# EAGLE design RPi-ShieldBridge_v11 (EAGLE 6.6.0)
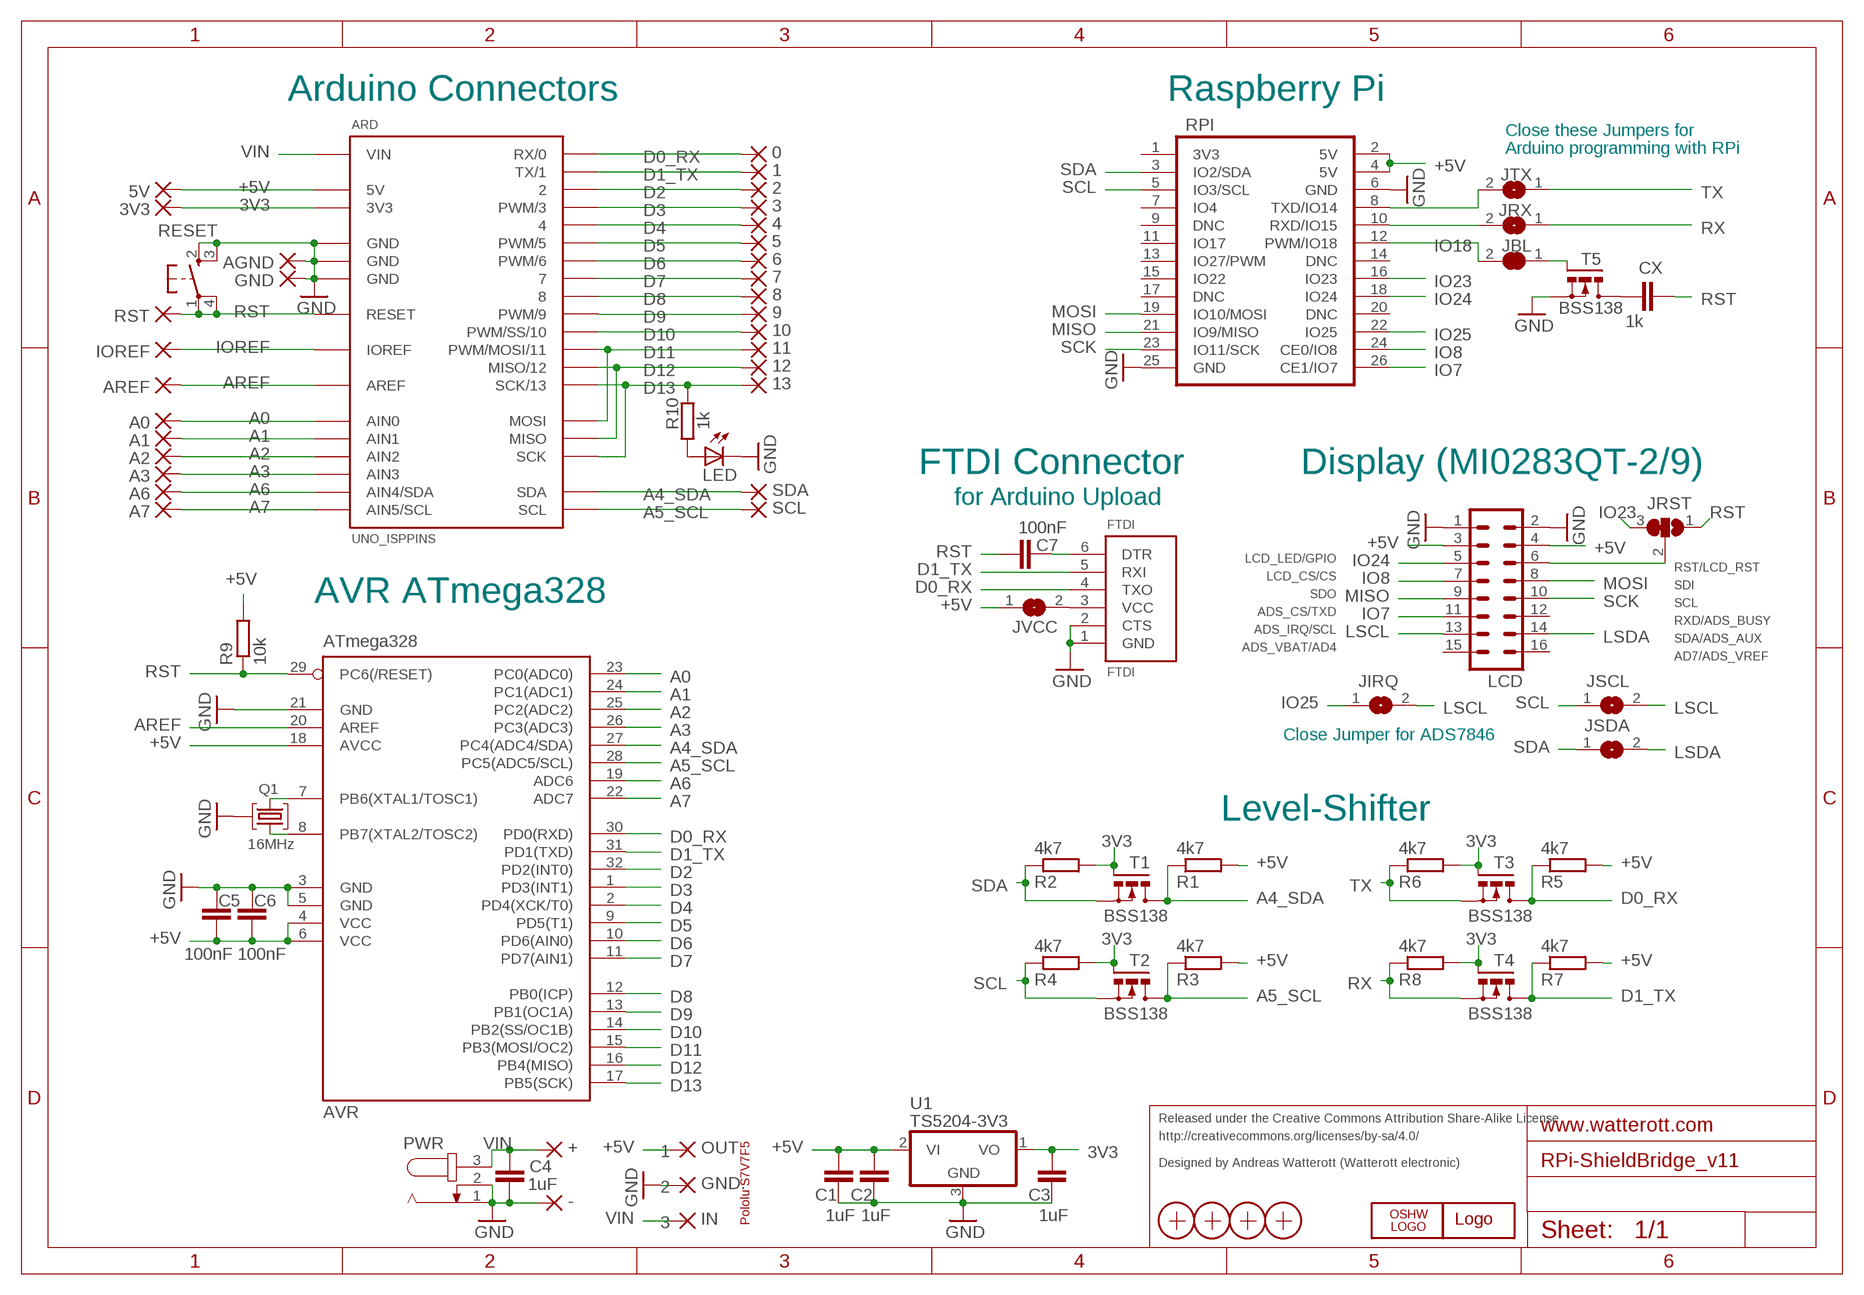
[diagram p0: schematic, sheet 1]

## Parts
0  WIREPAD1,6/0,9  [1,6/0,9]
1  WIREPAD1,6/0,9  [1,6/0,9]
2  WIREPAD1,6/0,9  [1,6/0,9]
3  WIREPAD1,6/0,9  [1,6/0,9]
3V3  WIREPAD1,6/0,9  [1,6/0,9]
4  WIREPAD1,6/0,9  [1,6/0,9]
5  WIREPAD1,6/0,9  [1,6/0,9]
5V  WIREPAD1,6/0,9  [1,6/0,9]
6  WIREPAD1,6/0,9  [1,6/0,9]
7  WIREPAD1,6/0,9  [1,6/0,9]
8  WIREPAD1,6/0,9  [1,6/0,9]
9  WIREPAD1,6/0,9  [1,6/0,9]
10  WIREPAD1,6/0,9  [1,6/0,9]
11  WIREPAD1,6/0,9  [1,6/0,9]
12  WIREPAD1,6/0,9  [1,6/0,9]
13  WIREPAD1,6/0,9  [1,6/0,9]
+  WIREPAD2,54/1,0  [2,54/1,0]
-  WIREPAD2,54/1,0  [2,54/1,0]
A0  WIREPAD1,6/0,9  [1,6/0,9]
A1  WIREPAD1,6/0,9  [1,6/0,9]
A2  WIREPAD1,6/0,9  [1,6/0,9]
A3  WIREPAD1,6/0,9  [1,6/0,9]
A6  WIREPAD1,6/0,9  [1,6/0,9]
A7  WIREPAD1,6/0,9  [1,6/0,9]
AGND  WIREPAD1,6/0,9  [1,6/0,9]
ARD  UNO_ISPPINS  [UNO_ISP3]
AREF  WIREPAD1,6/0,9  [1,6/0,9]
AVR  ATmega328  MEGA8-AI  [TQFP32-08]
C1  1uF  C-EUC0603  [C0603]
C2  1uF  C-EUC0603  [C0603]
C3  1uF  C-EUC0603  [C0603]
C4  1uF  C-EUC0603  [C0603]
C5  100nF  C-EUC0603  [C0603]
C6  100nF  C-EUC0603  [C0603]
C7  100nF  C-EUC0603  [C0603]
CX  1k  C-EUC0603  [C0603]
FTDI  FTDI  [FTDI]
GND  WIREPAD1,6/0,9  [1,6/0,9]
GND.  2  WIREPAD1,6/0,9  [1,6/0,9]
IN  3  WIREPAD1,6/0,9  [1,6/0,9]
IOREF  WIREPAD1,6/0,9  [1,6/0,9]
JBL  SJ  [SJ]
JIRQ  SJ  [SJ]
JRST  SJ2W  [SJ_2]
JRX  SJ  [SJ]
JSCL  SJ  [SJ]
JSDA  SJ  [SJ]
JTX  SJ  [SJ]
JVCC  SJ  [SJ]
LCD  MA08-2  [MA08-2]
LED  LEDCHIPLED_0603  [CHIPLED_0603]
LOGO1  OSHW_LOGO_6MILX0150-NT  [OSHW_6X150_NOTEXT]
OUT  1  WIREPAD1,6/0,9  [1,6/0,9]
PWR  DC-JACK""  [DC-JACK]
Q1  16MHz  SMD_OSC2  [SMD_OSC_35X15]
R1  4k7  R-EU_R0603  [R0603]
R2  4k7  R-EU_R0603  [R0603]
R3  4k7  R-EU_R0603  [R0603]
R4  4k7  R-EU_R0603  [R0603]
R5  4k7  R-EU_R0603  [R0603]
R6  4k7  R-EU_R0603  [R0603]
R7  4k7  R-EU_R0603  [R0603]
R8  4k7  R-EU_R0603  [R0603]
R9  10k  R-EU_R0603  [R0603]
R10  1k  R-EU_R0603  [R0603]
RESET  SW_SMDS  [SW_SMD4@1]
RPI  RPI  [RPI]
RST  WIREPAD1,6/0,9  [1,6/0,9]
SCL  WIREPAD1,6/0,9  [1,6/0,9]
SDA  WIREPAD1,6/0,9  [1,6/0,9]
T1  BSS138  IRLML2502  [MICRO3]
T2  BSS138  IRLML2502  [MICRO3]
T3  BSS138  IRLML2502  [MICRO3]
T4  BSS138  IRLML2502  [MICRO3]
T5  BSS138  IRLML2502  [MICRO3]
U1  TS5204-3V3  TS5204  [SOT23]
U$1  WE-LOGO  WE-LOGOPLACE  [WE-LOGO]
X1  PASSER  [PASSER]
X2  PASSER  [PASSER]
X3  PASSER  [PASSER]
X4  PASSER  [PASSER]

## Nets
3V3: 3V3.1(P) ARD.3V3 C3.1 R2.2 R4.2 R6.2 R8.2 T1.1(G) T2.1(G) T3.1(G) T4.1(G) U1.1(VO)
+5V: 5V.1(P) ARD.5V AVR.4(VCC) AVR.6(VCC) AVR.18(AVCC) C1.1 C2.1 C5.1 C6.1 JVCC.1 LCD.3 LCD.4 OUT.1(P) R1.2 R3.2 R5.2 R7.2 R9.2 RPI.2(5V) RPI.4(5V) U1.2(VI)
A0: A0.1(P) ARD.AIN0 AVR.23(PC0(ADC0))
A1: A1.1(P) ARD.AIN1 AVR.24(PC1(ADC1))
A2: A2.1(P) ARD.AIN2 AVR.25(PC2(ADC2))
A3: A3.1(P) ARD.AIN3 AVR.26(PC3(ADC3))
A4_SDA: ARD.SDA AVR.27(PC4(ADC4/SDA)) R1.1 SDA.1(P) T1.3(D)
A5_SCL: ARD.SCL AVR.28(PC5(ADC5/SCL)) R3.1 SCL.1(P) T2.3(D)
A6: A6.1(P) ARD.AIN4(AIN4/SDA) AVR.19(ADC6)
A7: A7.1(P) ARD.AIN5(AIN5/SCL) AVR.22(ADC7)
AREF: ARD.AREF AREF.1(P) AVR.20(AREF)
D0_RX: 0.1(P) ARD.0(RX/0) AVR.30(PD0(RXD)) FTDI.4(TXO) R5.1 T3.3(D)
D1_TX: 1.1(P) ARD.1(TX/1) AVR.31(PD1(TXD)) FTDI.5(RXI) R7.1 T4.3(D)
D2: 2.1(P) ARD.2 AVR.32(PD2(INT0))
D3: 3.1(P) ARD.3(PWM/3) AVR.1(PD3(INT1))
D4: 4.1(P) ARD.4 AVR.2(PD4(XCK/T0))
D5: 5.1(P) ARD.5(PWM/5) AVR.9(PD5(T1))
D6: 6.1(P) ARD.6(PWM/6) AVR.10(PD6(AIN0))
D7: 7.1(P) ARD.7 AVR.11(PD7(AIN1))
D8: 8.1(P) ARD.8 AVR.12(PB0(ICP))
D9: 9.1(P) ARD.9(PWM/9) AVR.13(PB1(OC1A))
D10: 10.1(P) ARD.10(PWM/SS/10) AVR.14(PB2(SS/OC1B))
D11: 11.1(P) ARD.11(PWM/MOSI/11) ARD.MOSI AVR.15(PB3(MOSI/OC2))
D12: 12.1(P) ARD.12(MISO/12) ARD.MISO AVR.16(PB4(MISO))
D13: 13.1(P) ARD.13(SCK/13) ARD.SCK AVR.17(PB5(SCK)) R10.1
DTR: C7.1 FTDI.6(DTR)
GND: -.1(P) AGND.1(P) ARD.GND@1(GND) ARD.GND@2(GND) ARD.GND@3(GND) AVR.3(GND) AVR.5(GND) AVR.21(GND) C1.2 C2.2 C3.2 C4.2 C5.2 C6.2 FTDI.1(GND) FTDI.2(CTS) GND.1(P) GND..1(P) LCD.1 LCD.2 LED.C PWR.1 PWR.2 Q1.GND RESET.2(S) RESET.3(S1) RPI.6(GND) RPI.25(GND) T5.2(S) U1.3(GND)
IO7: LCD.11 RPI.26(CE1/IO7)
IO8: LCD.7 RPI.24(CE0/IO8)
IO18: JBL.2 RPI.12(PWM/IO18)
IO23: JRST.3 RPI.16(IO23)
IO24: LCD.5 RPI.18(IO24)
IO25: JIRQ.1 RPI.22(IO25)
IOREF: ARD.IOREF IOREF.1(P)
LCD_RST: JRST.2 LCD.6
LSCL: JIRQ.2 JSCL.2 LCD.13
LSDA: JSDA.2 LCD.14
MISO: LCD.9 RPI.21(IO9/MISO)
MOSI: LCD.8 RPI.19(IO10/MOSI)
N$1: AVR.8(PB7(XTAL2/TOSC2)) Q1.2
N$2: AVR.7(PB6(XTAL1/TOSC1)) Q1.1
N$11: CX.1 T5.3(D)
N$12: LED.A R10.2
RPI_RST: JBL.1 T5.1(G)
RST: ARD.RST(RESET) AVR.29(PC6(/RESET)) C7.2 CX.2 JRST.1 R9.1 RESET.1(P) RESET.4(P1) RST.1(P)
RX: JRX.1 R8.1 T4.2(S)
RX_IO15: JRX.2 RPI.10(RXD/IO15)
SCK: LCD.10 RPI.23(IO11/SCK)
SCL: JSCL.1 R4.1 RPI.5(IO3/SCL) T2.2(S)
SDA: JSDA.1 R2.1 RPI.3(IO2/SDA) T1.2(S)
TX: JTX.1 R6.1 T3.2(S)
TX_IO14: JTX.2 RPI.8(TXD/IO14)
VCC: FTDI.3(VCC) JVCC.2
VIN: +.1(P) ARD.VIN C4.1 IN.1(P) PWR.3
Unconnected: LCD.12 LCD.15 LCD.16 RPI.1(3V3) RPI.7(IO4) RPI.9(DNC) RPI.11(IO17) RPI.13(IO27/PWM) RPI.14(DNC) RPI.15(IO22) RPI.17(DNC) RPI.20(DNC)

## Notes on the sheet
- Arduino Connectors | Raspberry Pi
- Close these Jumpers for
- Arduino programming with RPi
- FTDI Connector | Display (MI0283QT-2/9)
- for Arduino Upload
- LCD_LED/GPIO
- LCD_CS/CS | RST/LCD_RST
- SDO | SDI
- AVR ATmega328
- ADS_CS/TXD | SCL
- ADS_IRQ/SCL | RXD/ADS_BUSY
- ADS_VBAT/AD4 | SDA/ADS_AUX
- AD7/ADS_VREF
- Close Jumper for ADS7846
- Level-Shifter
- Released under the Creative Commons Attribution Share-Alike License
- http://creativecommons.org/licenses/by-sa/4.0/
- Designed by Andreas Watterott (Watterott electronic)
- Pololu S7V7F5

## Library data of the parts
0 1-3 3V3 4 5 5V 6-13 + - A0 A1-A3 A6 A7 AGND AREF GND GND. IN IOREF OUT RST SCL SDA = wirepad:WIREPAD: Wire PAD connect wire on PCB
ARD = Arduino:UNO_ISP: Arduino UNO
AVR = atmel:MEGA8: MICROCONTROLLER 8 Kbytes FLASH, 1 kbytes SRAM, 512 bytes EEPROM, USART, 6-channel 10 bit ADC, 2-channel 8 bit ADC Pin compatible with Atmega48, ATMega88, ATMega168 Source: avr.lbr; MPN: ATMEGA8-16AU; OC_FARNELL: 9171371; OC_NEWARK: 73M8863
C1-C7 CX = rcl:C-EU: CAPACITOR, European symbol
FTDI = Arduino:FTDI: 6pol FTDI Connector
JBL JIRQ JRX JSCL JSDA JTX JVCC = jumper:SJ: SMD solder JUMPER
JRST = jumper:SJ2W: SMD solder JUMPER
LCD = con-lstb:MA08-2: PIN HEADER
LED = led:LED: LED OSRAM: - CHIPLED LG R971, LG N971, LY N971, LG Q971, LY Q971, LO R971, LY R971 LH N974, LH R974 LS Q976, LO Q976, LY Q976 LO Q996 - Hyper CHIPLED LW Q18S LB Q993, LB Q99A, LB R99A - SideLED LS A670, LO A670, LY A670, LG A670, LP A670 LB A673, LV A673, LT A673, LW A673 LH A674 LY A675 LS A676, LA A676, LO A676, LY A676, LW A676 LS A679, LY A679, LG A679 - Hyper Micro SIDELED® LS Y876, LA Y876, LO Y876, LY Y876 LT Y87S - SmartLED LW L88C, LW L88S LB L89C, LB L89S, LG L890 LS L89K, LO L89K, LY L89K LS L896, LA L896, LO L896, LY L896 - TOPLED LS T670, LO T670, LY T670, LG T670, LP T670 LSG T670, LSP T670, LSY T670, LOP T670, LYG T670 LG T671, LOG T671, LSG T671 LB T673, LV T673, LT T673, LW T673 LH T674 LS T676, LA T676, LO T676, LY T676, LB T676, LH T676, LSB T676, LW T676 LB T67C, LV T67C, LT T67C, LS T67K, LO T67K, LY T67K, LW E67C LS E67B, LA E67B, LO E67B, LY E67B, LB E67C, LV E67C, LT E67C LW T67C LS T679, LY T679, LG T679 LS T770, LO T770, LY T770, LG T770, LP T770 LB T773, LV T773, LT T773, LW T773 LH T774 LS E675, LA E675, LY E675, LS T675 LS T776, LA T776, LO T776, LY T776, LB T776 LHGB T686 LT T68C, LB T68C - Hyper Mini TOPLED® LB M676 - Mini TOPLED Santana® LG M470 LS M47K, LO M47K, LY M47K Source: http://www.osram.convergy.de LUXEON: - LUMILED® LXK2-PW12-R00, LXK2-PW12-S00, LXK2-PW14-U00, LXK2-PW14-V00 LXK2-PM12-R00, LXK2-PM12-S00, LXK2-PM14-U00 LXK2-PE12-Q00, LXK2-PE12-R00, LXK2-PE12-S00, LXK2-PE14-T00, LXK2-PE14-U00 LXK2-PB12-K00, LXK2-PB12-L00, LXK2-PB12-M00, LXK2-PB14-N00, LXK2-PB14-P00, LXK2-PB14-Q00 LXK2-PR12-L00, LXK2-PR12-M00, LXK2-PR14-Q00, LXK2-PR14-R00 LXK2-PD12-Q00, LXK2-PD12-R00, LXK2-PD12-S00 LXK2-PH12-R00, LXK2-PH12-S00 LXK2-PL12-P00, LXK2-PL12-Q00, LXK2-PL12-R00 Source: www.luxeon.com KINGBRIGHT: KA-3528ASYC Source: www.kingbright.com
LOGO1 = OSHW:OSHW_LOGO_6MIL
PWR = V-Reg-Power:DC-JACK: DC POWER JACK Power Jack, DC, Right Angle, Through Hole, Rated 5A at 16VDC, PC Terminals Distributor: Farnell (www.Farnell.de) Drawing: 84N1161.pdf / 84N1162.pdf Manufacturer: SPC Technology (www.spctechnology.com) Type: SPC4077 / SPC 4078; OC_FARNELL: unknown; OC_NEWARK: unknown
Q1 = Crystal:SMD_OSC
R1-R10 = rcl:R-EU_: RESISTOR, European symbol
RESET = Switch-SMD:SW_SMD
RPI = RaspberryPi:RPI; OC_FARNELL: unknown; OC_NEWARK: unknown
T1-T5 = IRF-sot23:IRLML2502: N-Channel Power MOSFET
U1 = Voltage-Reg:TS5204
U$1 = welectronic:WE-LOGO
X1-X4 = SMD:PASSER

## Board
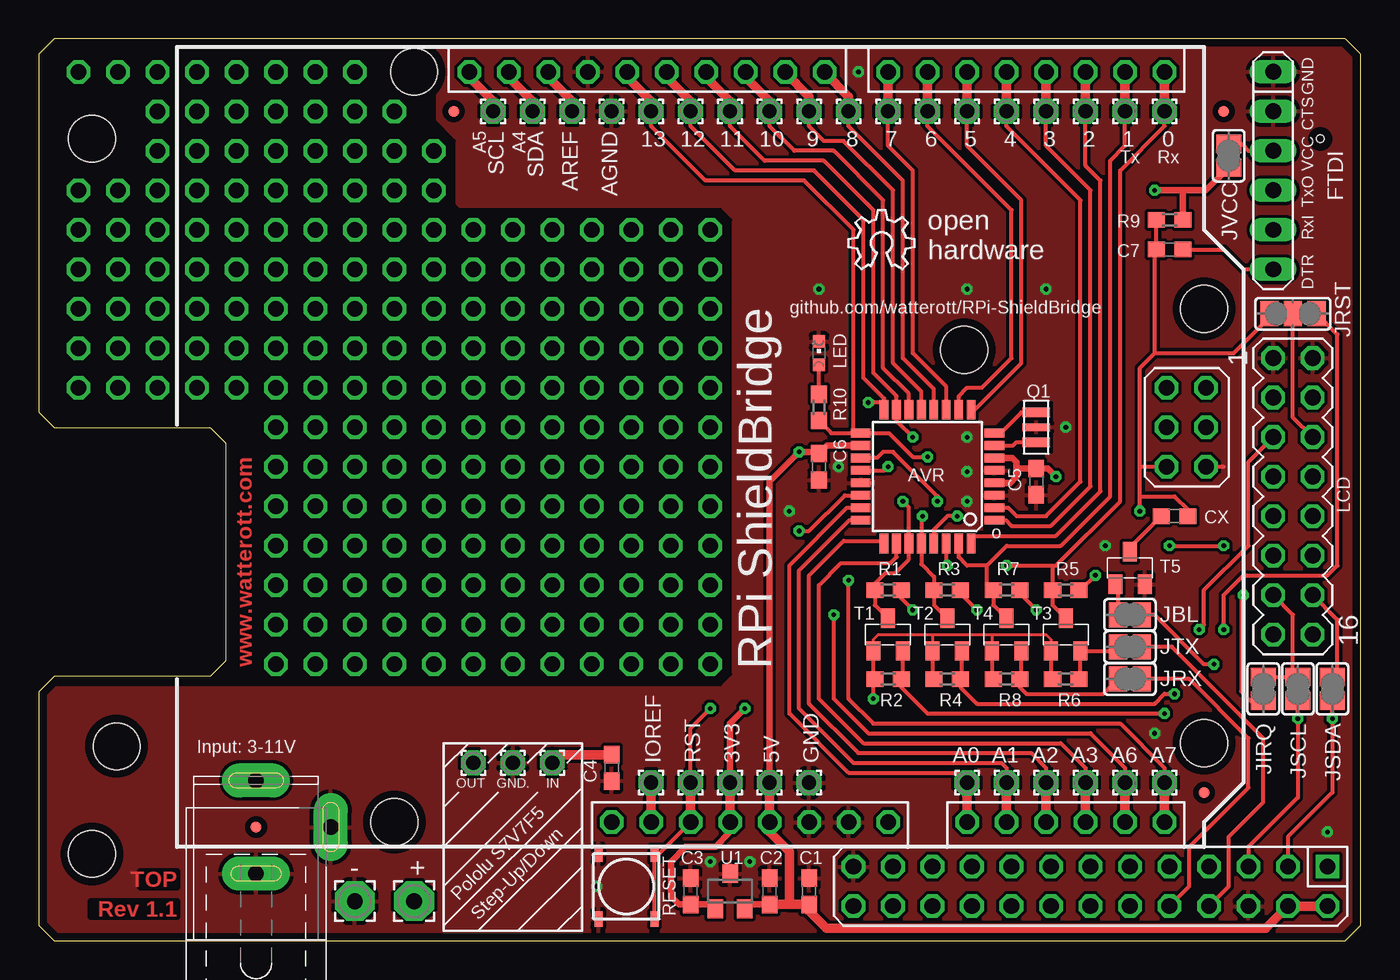
[diagram p1: board, top side]
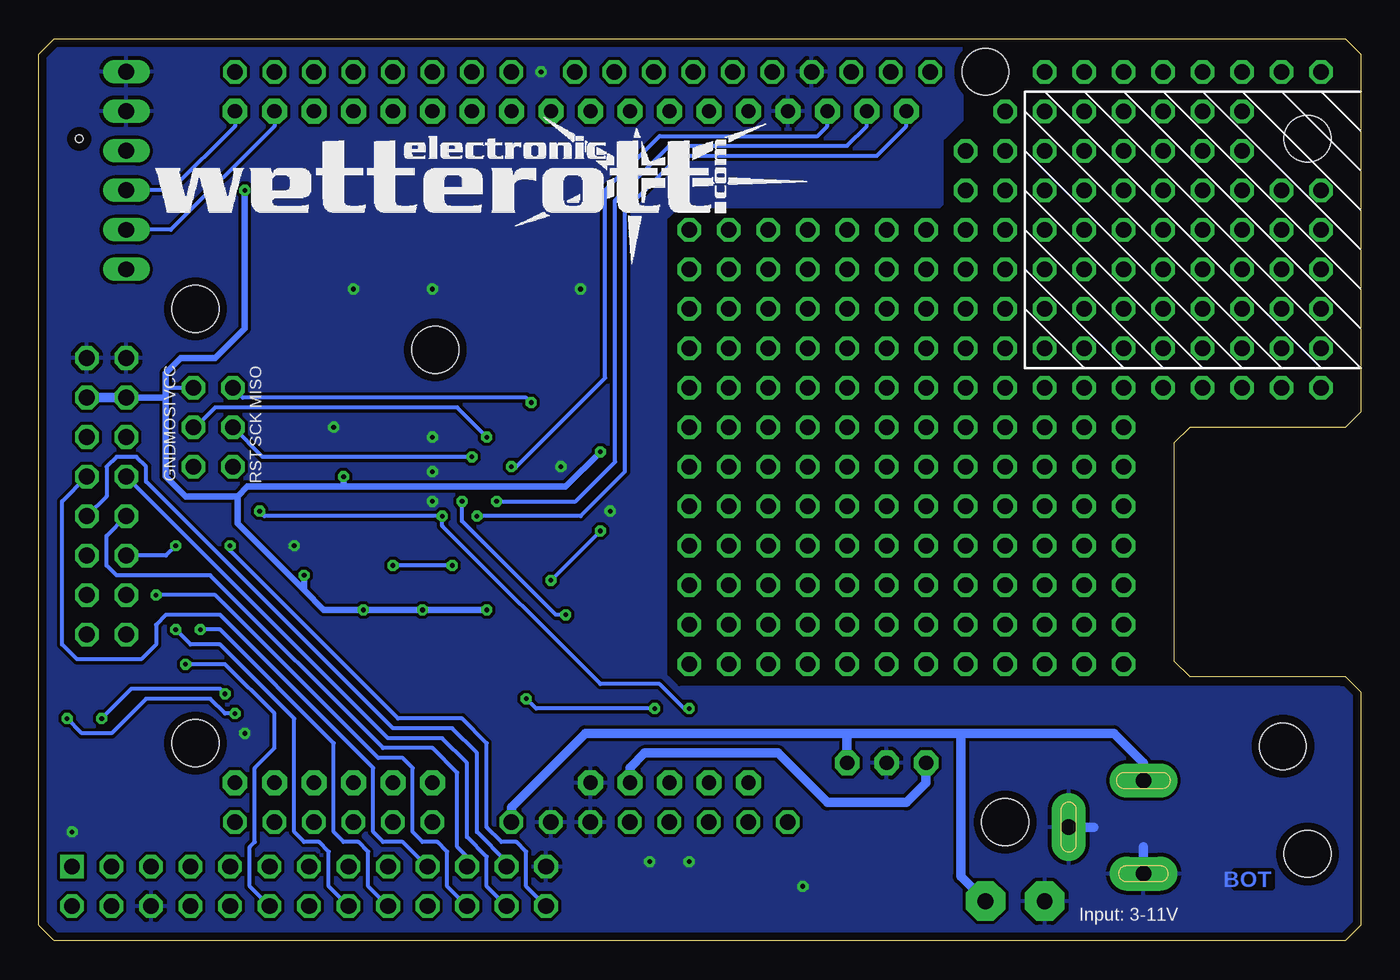
[diagram p2: board, bottom side, seen from below]

Size 85 x 58 mm. Coordinates in mm from the lower left corner, seen from the top.
Outline: 1,0 84,0 85,1 85,57 84,58 1,58 0,57 0,34 1,33 11,33 12,32 12,18 11,17 1,17 0,16 0,1 1,0
Copper layers (1*16): Top 0.035mm / dielectric 1.5mm / Bottom 0.035mm
Design rules "default *": minimum track width 8mil, minimum drill 0.3mm, track to track 8mil, track to pad 8mil, pad to pad 8mil, via to via 8mil, smd to smd 8mil, copper to edge 20mil, drill to drill 8mil, minimum pad ring 10mil, minimum via ring 8mil, stop-mask expansion 4mil, vias tented up to drill 0.5mm, thermal gap 10mil
Holes 3 mm at 5,12.5 59.5,38 3.41,5.58 3.41,51.58
Holes 0.5 mm at 82.41,51.58
tRestrict: area 61,31.4 to 65.1,34.6; area 1.3,16.5 to 44.5,57.1
bRestrict: area 1.3,16.5 to 44.5,57.1

### Footprints (pad centres in the part's own frame; a part is rotated, then mirrored left to right if it is on the bottom)
1,6/0,9 = drill 0.914 pad 1.6 octagon: 1 0,0
2,54/1,0 = drill 1.016 pad 2.54 octagon: 1 0,0
UNO_ISP3 = drill 1 octagon: 0 63.5,50.8; 1 60.96,50.8; 2 58.42,50.8; 3 55.88,50.8; 3V3 35.56,2.54; 4 53.34,50.8; 5 50.8,50.8; 5V 38.1,2.54; 6 48.26,50.8; 7 45.72,50.8; 8 41.656,50.8; 9 39.116,50.8; 10 36.576,50.8; 11 34.036,50.8; 12 31.496,50.8; 13 28.956,50.8; AIN0 50.8,2.54; AIN1 53.34,2.54; AIN2 55.88,2.54; AIN3 58.42,2.54; AIN4 60.96,2.54; AIN5 63.5,2.54; AREF 23.876,50.8; GND@1 40.64,2.54; GND@2 43.18,2.54; GND@3 26.416,50.8; GND@4 66.167,25.4; IOREF 30.48,2.54; MISO 63.627,30.48; MOSI 66.167,27.94; NC 27.94,2.54; RST 33.02,2.54; RST2 63.627,25.4; SCK 63.627,27.94; SCL 18.796,50.8; SDA 21.336,50.8; VCC 66.167,30.48; VIN 45.72,2.54 | hole 3: 66.04,35.56; 66.04,7.62; 15.24,50.8; 13.97,2.54
TQFP32-08 = smd 1.27 x 0.559: 1 -4.293,2.8; 2 -4.293,2; 3 -4.293,1.2; 4 -4.293,0.4; 5 -4.293,-0.4; 6 -4.293,-1.2; 7 -4.293,-2; 8 -4.293,-2.8; 17 4.293,-2.8; 18 4.293,-2; 19 4.293,-1.2; 20 4.293,-0.4; 21 4.293,0.4; 22 4.293,1.2; 23 4.293,2; 24 4.293,2.8 | smd 0.559 x 1.27: 9 -2.8,-4.293; 10 -2,-4.293; 11 -1.2,-4.293; 12 -0.4,-4.293; 13 0.4,-4.293; 14 1.2,-4.293; 15 2,-4.293; 16 2.8,-4.293; 25 2.8,4.293; 26 2,4.293; 27 1.2,4.293; 28 0.4,4.293; 29 -0.4,4.293; 30 -1.2,4.293; 31 -2,4.293; 32 -2.8,4.293
C0603 = smd 1.1 x 1: 1 -0.85,0; 2 0.85,0
FTDI = drill 1.016 long: 1 -6.35,0; 2 -3.81,0; 3 -1.27,0; 4 1.27,0; 5 3.81,0; 6 6.35,0
SJ = smd 1.168 x 1.6: 1 -0.762,0; 2 0.762,0
SJ_2 = smd 1.168 x 1.6: 1 -1.524,0; 2 0,0; 3 1.524,0
MA08-2 = drill 1.016 octagon: 1 -8.89,-1.27; 2 -8.89,1.27; 3 -6.35,-1.27; 4 -6.35,1.27; 5 -3.81,-1.27; 6 -3.81,1.27; 7 -1.27,-1.27; 8 -1.27,1.27; 9 1.27,-1.27; 10 1.27,1.27; 11 3.81,-1.27; 12 3.81,1.27; 13 6.35,-1.27; 14 6.35,1.27; 15 8.89,-1.27; 16 8.89,1.27
CHIPLED_0603 = smd 0.8 x 0.8: A 0,-0.75; C 0,0.75
DC-JACK = drill 1 pad 2.184 long: 1 -3,0; 2 0,-4.8; 3 3,0
SMD_OSC_35X15 = smd 0.635 x 1.778: 1 -0.965,0; 2 0.965,0 | smd 0.508 x 1.778: GND 0,0
R0603 = smd 1.1 x 1: 1 -0.85,0; 2 0.85,0
SW_SMD4@1 = smd 0.508 x 1.016: 1 -1.8,-2.1; 2 1.8,-2.1; 3 1.8,2.1; 4 -1.8,2.1
RPI = drill 1.016 square: 1 -15.24,-1.27 | drill 1.016 octagon: 2 -15.24,1.27; 3 -12.7,-1.27; 4 -12.7,1.27; 5 -10.16,-1.27; 6 -10.16,1.27; 7 -7.62,-1.27; 8 -7.62,1.27; 9 -5.08,-1.27; 10 -5.08,1.27; 11 -2.54,-1.27; 12 -2.54,1.27; 13 0,-1.27; 14 0,1.27; 15 2.54,-1.27; 16 2.54,1.27; 17 5.08,-1.27; 18 5.08,1.27; 19 7.62,-1.27; 20 7.62,1.27; 21 10.16,-1.27; 22 10.16,1.27; 23 12.7,-1.27; 24 12.7,1.27; 25 15.24,-1.27; 26 15.24,1.27
MICRO3 = smd 0.9 x 1.25: 1 -0.95,-1.05; 2 0.95,-1.05; 3 0,1.05
SOT23 = smd 1 x 1.2: 1 -0.95,-1.132; 2 0.95,-1.132; 3 0,1.132
PASSER = smd 0.7 x 0.7: X 0,0

### Placement (x,y rotation side)
0  72.39,53.34 0 top
1  69.85,53.34 0 top
2  67.31,53.34 0 top
3  64.77,53.34 0 top
3V3  44.45,10.16 90 top
4  62.23,53.34 0 top
5  59.69,53.34 0 top
5V  46.99,10.16 90 top
6  57.15,53.34 0 top
7  54.61,53.34 0 top
8  52.07,53.34 0 top
9  49.53,53.34 0 top
10  46.99,53.34 0 top
11  44.45,53.34 0 top
12  41.91,53.34 0 top
13  39.37,53.34 0 top
+  24.13,2.54 0 top
-  20.32,2.54 0 top
A0  59.69,10.16 0 top
A1  62.23,10.16 0 top
A2  64.77,10.16 0 top
A3  67.31,10.16 0 top
A6  69.85,10.16 0 top
A7  72.39,10.16 0 top
AGND  36.83,53.34 0 top
ARD  8.89,5.08 0 top
AREF  34.29,53.34 0 top
AVR  57.15,29.84 180 top
C1  49.53,3.17 90 top
C2  46.99,3.17 90 top
C3  41.91,3.17 90 top
C4  36.83,11.11 270 top
C5  64.14,29.53 270 top
C6  50.16,30.48 270 top
C7  72.71,44.45 180 top
CX  73.03,27.3 0 top
FTDI  79.38,49.53 270 top
GND  49.53,10.16 0 top
GND.  30.48,11.43 90 top
IN  33.02,11.43 90 top
IOREF  39.37,10.16 0 top
JBL  70.17,20.95 0 top
JIRQ  78.74,16.19 90 top
JRST  80.64,40.32 0 top
JRX  70.17,16.83 0 top
JSCL  80.96,16.19 90 top
JSDA  83.19,16.19 90 top
JTX  70.17,18.89 0 top
JVCC  76.52,50.48 90 top
LCD  80.64,28.57 270 top
LED  50.16,37.78 0 top
LOGO1  52.07,43.18 0 top
OUT  27.94,11.43 90 top
PWR  13.97,7.3 90 top
Q1  64.14,33.02 90 top
R1  54.61,22.54 0 top
R2  54.61,16.83 180 top
R3  58.42,22.54 0 top
R4  58.42,16.83 180 top
R5  66.04,22.54 0 top
R6  66.04,16.83 180 top
R7  62.23,22.54 0 top
R8  62.23,16.83 180 top
R9  72.71,46.35 0 top
R10  50.16,34.29 90 top
RESET  37.78,3.49 180 top
RPI  67.63,3.49 180 top
RST  41.91,10.16 0 top
SCL  29.21,53.34 0 top
SDA  31.75,53.34 0 top
T1  54.61,19.68 0 top
T2  58.42,19.68 0 top
T3  66.04,19.68 0 top
T4  62.23,19.68 0 top
T5  70.17,23.97 0 top
U1  44.45,3.17 0 top
U$1  77.79,43.18 0 bottom
X1  13.97,7.3 0 top
X2  26.67,53.34 0 top
X3  76.2,53.34 0 top
X4  74.93,9.53 0 top

### Tracks (layer width: path | path; a pad name or v marks a point on that pad's centre or on a via)
3V3  (via drill 0.3)
  Top 0.203: 57.47,19.68 53.98,19.68 53.66,19.37 T1.1 | 57.47,19.68 61.28,19.68 | 61.28,19.68 64.77,19.68 65.09,19.37 T3.1 | 57.47,19.68 57.47,18.73 | 61.28,19.68 61.28,18.73
  Top 0.254: 43.22,2.33 U1.1 | R4.2 57.47,16.93 T2.1 57.47,18.73 | R6.2 65.09,16.93 T3.1 | R8.2 61.28,16.93 T4.1 61.28,18.73 | T1.1 53.66,16.93 | 53.66,16.93 R2.2 | 53.66,16.93 v53.66,15.56
  Top 0.406: 43.22,2.33 C3.1 41.17,2.33 40.64,2.86 40.64,5.08 41.59,6.03 43.5,6.03 44.45,6.99 ARD.3V3 | 3V3.1 44.45,13.97 v45.4,14.92
  Top 0.61: ARD.3V3 3V3.1
  Bottom 0.254: v53.66,15.56 53.02,14.92 v45.4,14.92
+5V  (via drill 0.3)
  Top 0.254: 45.68,2.33 U1.2 | 50.06,31.43 C6.1 | 62.97,30.38 62.87,30.48 | R1.2 55.46,22.01 v56.2,21.27 | R3.2 59.27,22.33 v60.33,21.27 | R7.2 63.08,22.33 v64.14,21.27 | R5.2 66.99,22.54 v67.94,23.5
  Top 0.406: C2.1 45.68,2.33 | C1.1 49.53,1.91 | AVR.4 62.47,29.45 62.87,29.84 62.87,30.48 62.87,30.8 62.62,31.05 AVR.6 | AVR.18 50.68,31.84 C6.1 | 50.06,31.43 v48.9,31.43 46.99,29.53 5V.1 | 62.97,30.38 C5.1 64.87,30.38 v65.41,29.84 | v71.75,48.26 73.66,48.26 | 73.66,48.26 75.06,48.26 JVCC.1 | R9.2 73.56,48.16 73.66,48.26
  Top 0.61: RPI.2 RPI.4 78.9,0.79 50.64,0.79 49.53,1.91 | 48.26,2.33 C2.1 | 48.26,2.33 C1.1 | 48.26,2.33 48.26,5.71 46.99,6.99 ARD.5V 5V.1
  Bottom 0.254: 76.83,35.56 74.93,35.56
  Bottom 0.406: 65.41,29.21 v65.41,29.84 | 65.41,29.21 51.12,29.21 v48.9,31.43 | v56.2,21.27 v60.33,21.27 v64.14,21.27 66.67,21.27 67.94,22.54 | 65.41,29.21 71.6,29.21 72.23,28.57 | 72.23,28.57 72.23,26.83 67.94,22.54 | 76.83,34.92 76.83,29.84 75.56,28.57 72.23,28.57 | 76.83,34.92 76.83,35.56 76.83,36.51 75.88,37.47 73.66,37.47 71.75,39.37 v71.75,48.26 | 76.83,34.92 LCD.3 | 67.94,22.54 v67.94,23.5
  Bottom 0.61: LCD.3 LCD.4 | OUT.1 27.94,10.16 29.21,8.89 34.29,8.89 37.47,12.06 46.04,12.06 46.99,11.11 5V.1
A0
  Top 0.254: AVR.23 51.98,27.84 48.26,24.13 48.26,14.61 52.07,10.79 59.05,10.79 A0.1
  Top 0.61: A0.1 ARD.AIN0
A1
  Top 0.254: AVR.24 52.13,27.05 48.9,23.81 48.9,14.92 52.39,11.43 61.91,11.43 62.23,11.11 A1.1
  Top 0.61: A1.1 ARD.AIN1
A2
  Top 0.254: AVR.25 54.19,25.72 51.75,25.72 49.53,23.5 49.53,15.24 52.7,12.06 63.82,12.06 64.77,11.11 A2.1
  Top 0.61: A2.1 ARD.AIN2
A3
  Top 0.254: AVR.26 55.15,24.67 54.77,24.29 51.59,24.29 50.16,22.86 50.16,15.56 53.02,12.7 65.72,12.7 67.31,11.11 A3.1
  Top 0.61: A3.1 ARD.AIN3
A4_SDA  (via drill 0.3)
  Top 0.254: T1.3 53.76,21.59 R1.1 53.76,22.96 54.45,23.65 55.09,23.65 55.95,24.52 AVR.27 55.95,27.87 v55.56,28.26
  Top 0.61: ARD.SDA 30.23,55.5 31.75,53.98 SDA.1
  Bottom 0.254: SDA.1 31.75,52.39 33.02,51.12 44.45,51.12 47.94,47.62 47.94,30.8 50.48,28.26 v55.56,28.26
A5_SCL  (via drill 0.3)
  Top 0.254: T2.3 57.57,21.59 R3.1 57.57,23.39 56.75,24.21 AVR.28 56.75,27.22 v56.83,27.3
  Top 0.61: ARD.SCL 27.69,55.5 29.21,53.98 SCL.1
  Bottom 0.254: SCL.1 29.21,52.39 31.11,50.48 43.81,50.48 47.31,46.99 47.31,30.16 50.16,27.3 v56.83,27.3
A6  (via drill 0.3)
  Top 0.254: v51.12,20.95 51.12,15.56 53.34,13.34 67.63,13.34 69.85,11.11 A6.1 | AVR.19 53.91,31.05 54.29,31.43 54.93,31.43 57.78,28.57 v57.78,28.26
  Top 0.61: A6.1 ARD.AIN4
  Bottom 0.254: v51.12,20.95 51.75,20.95 57.78,26.99 v57.78,28.26
A7  (via drill 0.3)
  Top 0.254: v52.07,23.18 52.07,15.56 53.66,13.97 69.53,13.97 72.39,11.11 A7.1 | AVR.22 51.82,28.64 49.53,26.35 v48.9,26.35
  Top 0.61: A7.1 ARD.AIN5
  Bottom 0.254: v52.07,23.18 v48.9,26.35
AREF  (via drill 0.3)
  Top 0.254: AVR.20 54.38,30.25 v54.61,30.48
  Top 0.61: ARD.AREF 32.77,55.5 34.29,53.98 AREF.1
  Bottom 0.254: AREF.1 34.29,52.39 34.92,51.75 45.09,51.75 48.58,48.26 48.58,36.2 54.29,30.48 v54.61,30.48
D0_RX  (via drill 0.3)
  Top 0.254: T3.3 65.19,21.59 R5.1 65.19,24.03 65.09,24.13 | 0.1 72.39,52.39 69.53,49.53 69.53,28.26 65.41,24.13 65.09,24.13 | AVR.30 58.35,24.2 v58.42,24.13 | v62.23,24.13 65.09,24.13
  Top 0.61: 0.1 ARD.0
  Bottom 0.254: v58.42,24.13 v62.23,24.13 | FTDI.4 76.52,48.26 72.39,52.39 0.1
D1_TX
  Top 0.254: T4.3 61.38,21.59 R7.1 60.96,22.96 60.96,24.13 | AVR.31 59.15,24.67 59.69,24.13 60.96,24.13 | 60.96,24.13 62.23,25.4 65.72,25.4 68.9,28.57 68.9,50.16 69.85,51.12 1.1
  Top 0.61: 1.1 ARD.1
  Bottom 0.254: FTDI.5 76.52,45.72 69.85,52.39 1.1
D2
  Top 0.254: AVR.32 59.95,25.98 60.01,26.04 65.41,26.04 68.26,28.89 68.26,48.9 67.31,49.85 2.1
  Top 0.61: 2.1 ARD.2
D3
  Top 0.254: AVR.1 62.17,27.05 62.55,26.67 65.09,26.67 67.63,29.21 67.63,48.26 64.77,51.12 3.1
  Top 0.61: 3.1 ARD.3
D4
  Top 0.254: AVR.2 62.33,27.84 62.87,27.3 64.77,27.3 66.99,29.53 66.99,47.62 62.23,52.39 4.1
  Top 0.61: 4.1 ARD.4
D5
  Top 0.254: AVR.9 59.95,33.91 63.18,37.15 63.18,47.62 59.69,51.12 5.1
  Top 0.61: 5.1 ARD.5
D6
  Top 0.254: AVR.10 59.15,35.02 59.69,35.56 60.64,35.56 62.55,37.47 62.55,46.99 57.15,52.39 6.1
  Top 0.61: 6.1 ARD.6
D7
  Top 0.254: AVR.11 58.35,35.63 56.2,37.78 56.2,49.53 54.61,51.12 7.1
  Top 0.61: 7.1 ARD.7
D8
  Top 0.254: AVR.12 57.55,35.48 55.56,37.47 55.56,48.9 52.07,52.39 8.1 | 50.55,55.82 ARD.8
  Top 0.61: 50.55,55.82 52.07,54.29 8.1
D9
  Top 0.254: AVR.13 56.75,35.33 54.93,37.15 54.93,48.26 51.75,51.44 50.48,51.44 49.53,52.39 9.1 | 48.01,55.82 ARD.9
  Top 0.61: 48.01,55.82 49.53,54.29 9.1
D10
  Top 0.254: AVR.14 55.95,35.17 54.29,36.83 54.29,47.62 51.12,50.8 48.58,50.8 46.99,52.39 10.1
  Top 0.61: ARD.10 45.47,55.5 46.99,53.98 10.1
D11  (via drill 0.3)
  Top 0.254: 11.1 44.45,52.39 46.67,50.16 50.48,50.16 53.66,46.99 53.66,36.51 55.15,35.02 AVR.15 55.15,33.43 v56.2,32.38
  Top 0.61: ARD.11 42.93,55.5 44.45,53.98 11.1
  Bottom 0.254: ARD.MOSI 74.93,33.02 73.66,34.29 58.1,34.29 v56.2,32.38
D12  (via drill 0.3)
  Top 0.254: AVR.16 54.35,34.66 | 54.35,34.66 54.35,34.87 53.02,36.2 53.02,46.35 49.85,49.53 44.77,49.53 41.91,52.39 12.1 | 54.35,34.66 54.29,34.61 v53.34,34.61
  Top 0.61: ARD.12 40.39,55.5 41.91,53.98 12.1
  Bottom 0.254: v53.34,34.61 53.66,34.92 71.88,34.92 ARD.MISO
D13  (via drill 0.3)
  Top 0.254: R10.1 50.96,32.65 AVR.17 | 13.1 39.37,52.39 42.86,48.9 49.21,48.9 52.39,45.72 52.39,32.7 52.45,32.65 AVR.17 | AVR.17 54.67,32.65 56.2,31.11 v57.15,31.11
  Top 0.61: ARD.13 37.85,55.5 39.37,53.98 13.1
  Bottom 0.254: v57.15,31.11 70.61,31.11 ARD.SCK
DTR
  Top 0.254: FTDI.6 77.47,43.18 76.2,44.45 C7.1
GND  (via drill 0.3)
  Top 0.254: 74.93,30.48 76.2,30.48
  Bottom 0.61: PWR.1 13.97,6.03 | 17.14,7.3 PWR.2
  other vias: 45.72,5.08 43.18,5.08 66.04,33.02 59.69,30.16 51.44,30.48 59.69,28.26 59.69,32.38 50.16,41.91 48.26,27.62 64.77,41.91 59.69,41.91 68.58,25.4 71.75,13.34 52.7,55.88 35.88,3.49 82.87,6.99
  pour Top: 0,0 85,0 85,58 0,58
  pour Bottom: 0,0 85,0 85,58 0,58
IO7  (via drill 0.3)
  Top 0.254: v72.71,25.4 v76.2,25.4
  Bottom 0.254: RPI.26 53.66,3.49 53.66,5.71 54.29,6.35 55.24,6.35 56.2,7.3 56.2,12.7 57.78,14.29 61.91,14.29 72.71,25.08 v72.71,25.4 | LCD.11 76.83,24.77 v76.2,25.4
IO8
  Bottom 0.254: RPI.24 56.2,3.49 56.2,5.4 57.47,6.67 57.47,11.43 59.05,13.02 62.55,13.02 LCD.7
IO18  (via drill 0.3)
  Top 0.254: JBL.2 71.75,20.95 74.93,17.78 v75.56,17.78
  Bottom 0.254: RPI.12 71.44,3.49 71.44,6.03 71.12,6.35 71.12,11.11 69.85,12.38 69.85,14.61 73.03,17.78 v75.56,17.78
IO23  (via drill 0.3)
  Top 0.254: v76.2,20 76.2,22.23 77.47,23.5 82.87,23.5 83.5,24.13 83.5,38.99 JRST.3
  Bottom 0.254: RPI.16 66.36,3.49 66.36,5.71 66.99,6.35 67.94,6.35 68.58,6.99 68.58,14.29 73.34,19.05 75.25,19.05 v76.2,20
IO24  (via drill 0.3)
  Top 0.254: LCD.5 77.79,30.8 77.79,25.4 74.93,22.54 74.93,20.32 v74.61,20
  Bottom 0.254: RPI.18 63.82,3.49 63.82,5.71 64.45,6.35 65.41,6.35 66.04,6.99 66.04,12.7 73.34,20 v74.61,20
IO25  (via drill 0.3)
  Top 0.254: JIRQ.1 77.92,15.43 77.31,16.03 77.31,22.07 v77.47,22.23
  Bottom 0.254: RPI.22 58.74,3.49 58.74,5.71 59.37,6.35 60.33,6.35 60.96,6.99 60.96,11.11 61.59,11.75 63.18,11.75 73.66,22.23 v77.47,22.23
IOREF
  Top 0.61: ARD.IOREF IOREF.1
LCD_RST
  Top 0.254: LCD.6 80.64,33.66 JRST.2 82.23,40.32
LSCL
  Top 0.254: JIRQ.2 JSCL.2 80.64,17.27 80.64,20.95 LCD.13
LSDA
  Top 0.254: JSDA.2 83.38,16.95 83.5,16.83 83.5,20.64 LCD.14
MISO
  Bottom 0.254: LCD.9 80.64,26.04 80.64,24.13 80.01,23.5 73.98,23.5 62.87,12.38 59.69,12.38 58.1,10.79 58.1,6.03 57.47,5.4 RPI.21
MOSI
  Bottom 0.254: LCD.8 83.5,28.26 83.5,19.05 82.55,18.1 78.42,18.1 77.47,19.05 77.47,20.32 76.83,20.95 73.34,20.95 63.5,11.11 63.5,6.99 62.87,6.35 61.59,6.35 RPI.19
N$1
  Top 0.254: AVR.8 61.85,32.65 63.18,33.97 64.12,33.97 Q1.2
N$2
  Top 0.254: AVR.7 62.64,31.84 62.87,32.07 64.12,32.07 Q1.1
N$3  (via drill 1)
  other vias: 40.64,17.78
N$4  (via drill 1)
  other vias: 38.1,17.78
N$5  (via drill 1)
  other vias: 43.18,17.78
N$6  (via drill 1)
  other vias: 35.56,17.78
N$7  (via drill 1)
  other vias: 33.02,17.78
N$8  (via drill 1)
  other vias: 30.48,17.78
N$9  (via drill 1)
  other vias: 27.94,17.78
N$10  (via drill 1)
  other vias: 25.4,17.78
N$11
  Top 0.254: T5.3 70.17,25.3 CX.1
N$12
  Top 0.254: R10.2 LED.A
N$13  (via drill 1)
  other vias: 22.86,17.78
N$14  (via drill 1)
  other vias: 20.32,17.78
N$15  (via drill 1)
  other vias: 17.78,17.78
N$16  (via drill 1)
  other vias: 15.24,17.78
N$17  (via drill 1)
  other vias: 43.18,20.32
N$18  (via drill 1)
  other vias: 40.64,20.32
N$19  (via drill 1)
  other vias: 38.1,20.32
N$20  (via drill 1)
  other vias: 35.56,20.32
N$21  (via drill 1)
  other vias: 33.02,20.32
N$22  (via drill 1)
  other vias: 30.48,20.32
N$23  (via drill 1)
  other vias: 27.94,20.32
N$24  (via drill 1)
  other vias: 25.4,20.32
N$25  (via drill 1)
  other vias: 22.86,20.32
N$26  (via drill 1)
  other vias: 20.32,20.32
N$27  (via drill 1)
  other vias: 17.78,20.32
N$28  (via drill 1)
  other vias: 15.24,20.32
N$29  (via drill 1)
  other vias: 43.18,22.86
N$30  (via drill 1)
  other vias: 40.64,22.86
N$31  (via drill 1)
  other vias: 38.1,22.86
N$32  (via drill 1)
  other vias: 35.56,22.86
N$33  (via drill 1)
  other vias: 33.02,22.86
N$34  (via drill 1)
  other vias: 30.48,22.86
N$35  (via drill 1)
  other vias: 27.94,22.86
N$36  (via drill 1)
  other vias: 25.4,22.86
N$37  (via drill 1)
  other vias: 22.86,22.86
N$38  (via drill 1)
  other vias: 20.32,22.86
N$39  (via drill 1)
  other vias: 17.78,22.86
N$40  (via drill 1)
  other vias: 15.24,22.86
N$41  (via drill 1)
  other vias: 43.18,25.4
N$42  (via drill 1)
  other vias: 40.64,25.4
N$43  (via drill 1)
  other vias: 38.1,25.4
N$44  (via drill 1)
  other vias: 35.56,25.4
N$45  (via drill 1)
  other vias: 33.02,25.4
N$46  (via drill 1)
  other vias: 30.48,25.4
N$47  (via drill 1)
  other vias: 27.94,25.4
N$48  (via drill 1)
  other vias: 25.4,25.4
N$49  (via drill 1)
  other vias: 22.86,25.4
N$50  (via drill 1)
  other vias: 20.32,25.4
N$51  (via drill 1)
  other vias: 17.78,25.4
N$52  (via drill 1)
  other vias: 15.24,25.4
N$53  (via drill 1)
  other vias: 43.18,27.94
N$54  (via drill 1)
  other vias: 40.64,27.94
N$55  (via drill 1)
  other vias: 38.1,27.94
N$56  (via drill 1)
  other vias: 35.56,27.94
N$57  (via drill 1)
  other vias: 33.02,27.94
N$58  (via drill 1)
  other vias: 30.48,27.94
N$59  (via drill 1)
  other vias: 27.94,27.94
N$60  (via drill 1)
  other vias: 25.4,27.94
N$61  (via drill 1)
  other vias: 22.86,27.94
N$62  (via drill 1)
  other vias: 20.32,27.94
N$63  (via drill 1)
  other vias: 17.78,27.94
N$64  (via drill 1)
  other vias: 15.24,27.94
N$65  (via drill 1)
  other vias: 43.18,30.48
N$66  (via drill 1)
  other vias: 40.64,30.48
N$67  (via drill 1)
  other vias: 38.1,30.48
N$68  (via drill 1)
  other vias: 35.56,30.48
N$69  (via drill 1)
  other vias: 33.02,30.48
N$70  (via drill 1)
  other vias: 30.48,30.48
N$71  (via drill 1)
  other vias: 27.94,30.48
N$72  (via drill 1)
  other vias: 25.4,30.48
N$73  (via drill 1)
  other vias: 22.86,30.48
N$74  (via drill 1)
  other vias: 20.32,30.48
N$75  (via drill 1)
  other vias: 17.78,30.48
N$76  (via drill 1)
  other vias: 15.24,30.48
N$77  (via drill 1)
  other vias: 43.18,33.02
N$78  (via drill 1)
  other vias: 40.64,33.02
N$79  (via drill 1)
  other vias: 38.1,33.02
N$80  (via drill 1)
  other vias: 35.56,33.02
N$81  (via drill 1)
  other vias: 33.02,33.02
N$82  (via drill 1)
  other vias: 30.48,33.02
N$83  (via drill 1)
  other vias: 27.94,33.02
N$84  (via drill 1)
  other vias: 25.4,33.02
N$85  (via drill 1)
  other vias: 22.86,33.02
N$86  (via drill 1)
  other vias: 20.32,33.02
N$87  (via drill 1)
  other vias: 17.78,33.02
N$88  (via drill 1)
  other vias: 15.24,33.02
N$89  (via drill 1)
  other vias: 43.18,35.56
N$90  (via drill 1)
  other vias: 40.64,35.56
N$91  (via drill 1)
  other vias: 38.1,35.56
N$92  (via drill 1)
  other vias: 35.56,35.56
N$93  (via drill 1)
  other vias: 33.02,35.56
N$94  (via drill 1)
  other vias: 30.48,35.56
N$95  (via drill 1)
  other vias: 27.94,35.56
N$96  (via drill 1)
  other vias: 25.4,35.56
N$97  (via drill 1)
  other vias: 22.86,35.56
N$98  (via drill 1)
  other vias: 20.32,35.56
N$99  (via drill 1)
  other vias: 17.78,35.56
N$100  (via drill 1)
  other vias: 15.24,35.56
N$101  (via drill 1)
  other vias: 12.7,35.56
N$102  (via drill 1)
  other vias: 10.16,35.56
N$103  (via drill 1)
  other vias: 7.62,35.56
N$104  (via drill 1)
  other vias: 5.08,35.56
N$105  (via drill 1)
  other vias: 2.54,35.56
N$106  (via drill 1)
  other vias: 43.18,38.1
N$107  (via drill 1)
  other vias: 40.64,38.1
N$108  (via drill 1)
  other vias: 38.1,38.1
N$109  (via drill 1)
  other vias: 35.56,38.1
N$110  (via drill 1)
  other vias: 33.02,38.1
N$111  (via drill 1)
  other vias: 30.48,38.1
N$112  (via drill 1)
  other vias: 27.94,38.1
N$113  (via drill 1)
  other vias: 25.4,38.1
N$114  (via drill 1)
  other vias: 22.86,38.1
N$115  (via drill 1)
  other vias: 20.32,38.1
N$116  (via drill 1)
  other vias: 17.78,38.1
N$117  (via drill 1)
  other vias: 15.24,38.1
N$118  (via drill 1)
  other vias: 12.7,38.1
N$119  (via drill 1)
  other vias: 10.16,38.1
N$120  (via drill 1)
  other vias: 7.62,38.1
N$121  (via drill 1)
  other vias: 5.08,38.1
N$122  (via drill 1)
  other vias: 2.54,38.1
N$123  (via drill 1)
  other vias: 43.18,40.64
N$124  (via drill 1)
  other vias: 40.64,40.64
N$125  (via drill 1)
  other vias: 38.1,40.64
N$126  (via drill 1)
  other vias: 35.56,40.64
N$127  (via drill 1)
  other vias: 33.02,40.64
N$128  (via drill 1)
  other vias: 30.48,40.64
N$129  (via drill 1)
  other vias: 27.94,40.64
N$130  (via drill 1)
  other vias: 25.4,40.64
N$131  (via drill 1)
  other vias: 22.86,40.64
N$132  (via drill 1)
  other vias: 20.32,40.64
N$133  (via drill 1)
  other vias: 17.78,40.64
N$134  (via drill 1)
  other vias: 15.24,40.64
N$135  (via drill 1)
  other vias: 12.7,40.64
N$136  (via drill 1)
  other vias: 10.16,40.64
N$137  (via drill 1)
  other vias: 7.62,40.64
N$138  (via drill 1)
  other vias: 5.08,40.64
N$139  (via drill 1)
  other vias: 2.54,40.64
N$140  (via drill 1)
  other vias: 43.18,43.18
N$141  (via drill 1)
  other vias: 40.64,43.18
N$142  (via drill 1)
  other vias: 38.1,43.18
N$143  (via drill 1)
  other vias: 35.56,43.18
N$144  (via drill 1)
  other vias: 33.02,43.18
N$145  (via drill 1)
  other vias: 30.48,43.18
N$146  (via drill 1)
  other vias: 27.94,43.18
N$147  (via drill 1)
  other vias: 25.4,43.18
N$148  (via drill 1)
  other vias: 22.86,43.18
N$149  (via drill 1)
  other vias: 20.32,43.18
N$150  (via drill 1)
  other vias: 17.78,43.18
N$151  (via drill 1)
  other vias: 15.24,43.18
N$152  (via drill 1)
  other vias: 12.7,43.18
N$153  (via drill 1)
  other vias: 10.16,43.18
N$154  (via drill 1)
  other vias: 7.62,43.18
N$155  (via drill 1)
  other vias: 5.08,43.18
N$156  (via drill 1)
  other vias: 2.54,43.18
N$157  (via drill 1)
  other vias: 43.18,45.72
N$158  (via drill 1)
  other vias: 40.64,45.72
N$159  (via drill 1)
  other vias: 38.1,45.72
N$160  (via drill 1)
  other vias: 35.56,45.72
N$161  (via drill 1)
  other vias: 33.02,45.72
N$162  (via drill 1)
  other vias: 30.48,45.72
N$163  (via drill 1)
  other vias: 27.94,45.72
N$164  (via drill 1)
  other vias: 25.4,45.72
N$165  (via drill 1)
  other vias: 22.86,45.72
N$166  (via drill 1)
  other vias: 20.32,45.72
N$167  (via drill 1)
  other vias: 17.78,45.72
N$168  (via drill 1)
  other vias: 15.24,45.72
N$169  (via drill 1)
  other vias: 12.7,45.72
N$170  (via drill 1)
  other vias: 10.16,45.72
N$171  (via drill 1)
  other vias: 7.62,45.72
N$172  (via drill 1)
  other vias: 5.08,45.72
N$173  (via drill 1)
  other vias: 2.54,45.72
N$174  (via drill 1)
  other vias: 25.4,48.26
N$175  (via drill 1)
  other vias: 22.86,48.26
N$176  (via drill 1)
  other vias: 20.32,48.26
N$177  (via drill 1)
  other vias: 17.78,48.26
N$178  (via drill 1)
  other vias: 15.24,48.26
N$179  (via drill 1)
  other vias: 12.7,48.26
N$180  (via drill 1)
  other vias: 10.16,48.26
N$181  (via drill 1)
  other vias: 7.62,48.26
N$182  (via drill 1)
  other vias: 5.08,48.26
N$183  (via drill 1)
  other vias: 2.54,48.26
N$184  (via drill 1)
  other vias: 25.4,50.8
N$185  (via drill 1)
  other vias: 22.86,50.8
N$186  (via drill 1)
  other vias: 20.32,50.8
N$187  (via drill 1)
  other vias: 17.78,50.8
N$188  (via drill 1)
  other vias: 15.24,50.8
N$189  (via drill 1)
  other vias: 12.7,50.8
N$190  (via drill 1)
  other vias: 10.16,50.8
N$191  (via drill 1)
  other vias: 7.62,50.8
N$194  (via drill 1)
  other vias: 22.86,53.34
N$195  (via drill 1)
  other vias: 20.32,53.34
N$196  (via drill 1)
  other vias: 17.78,53.34
N$197  (via drill 1)
  other vias: 15.24,53.34
N$198  (via drill 1)
  other vias: 12.7,53.34
N$199  (via drill 1)
  other vias: 10.16,53.34
N$200  (via drill 1)
  other vias: 7.62,53.34
N$201  (via drill 1)
  other vias: 20.32,55.88
N$202  (via drill 1)
  other vias: 17.78,55.88
N$203  (via drill 1)
  other vias: 15.24,55.88
N$204  (via drill 1)
  other vias: 12.7,55.88
N$205  (via drill 1)
  other vias: 10.16,55.88
N$206  (via drill 1)
  other vias: 7.62,55.88
N$207  (via drill 1)
  other vias: 5.08,55.88
N$208  (via drill 1)
  other vias: 2.54,55.88
RPI_RST
  Top 0.254: JBL.1 69.41,22.73 T5.1
RST  (via drill 0.3)
  Top 0.254: AVR.29 57.55,26.43 58.42,27.3 v59.05,27.3 | R9.1 C7.2 71.75,44.35 71.75,37.78 | JRST.1 79.12,40.07 76.83,37.78 71.75,37.78 | RST.1 41.91,13.65 v43.18,14.92 | RESET.4 RESET.1 39.88,5.59 ARD.RST | v70.8,27.62 70.8,28.57 | 70.8,28.57 70.8,30.48 | 70.8,30.48 70.8,36.83 71.75,37.78 | 70.8,30.48 72.39,30.48 | CX.2 73.88,27.73 73.03,28.57 70.8,28.57
  Top 0.61: ARD.RST RST.1
  Bottom 0.254: v70.8,27.62 70.48,27.3 v59.05,27.3 59.05,26.67 48.9,16.51 45.09,16.51 43.5,14.92 v43.18,14.92
RX
  Top 0.254: T4.2 63.18,16.93 R8.1 63.08,16.3 63.5,15.88 68.45,15.88 JRX.1
RX_IO15
  Top 0.254: RPI.10 73.98,3.49 73.98,6.03 77.79,9.84 77.79,13.02 73.98,16.83 JRX.2
SCK
  Bottom 0.254: RPI.23 54.93,5.08 56.83,6.99 56.83,12.06 58.42,13.65 62.23,13.65 78.11,29.53 78.11,30.48 78.74,31.11 80.01,31.11 80.64,30.48 80.64,28.57 LCD.10
SCL  (via drill 0.3)
  Top 0.254: T2.2 59.37,16.93 R4.1 59.27,16.3 60.33,15.24 71.75,15.24 72.39,15.88 v73.03,15.88 | JSCL.1 v80.96,14.29 80.96,9.21 77.79,6.03 RPI.5
  Bottom 0.254: v73.03,15.88 73.34,16.19 79.06,16.19 v80.96,14.29
SDA  (via drill 0.3)
  Top 0.254: T1.2 55.56,16.93 R2.1 55.46,16.3 57.15,14.61 v72.39,14.61 | JSDA.1 v83.19,14.29 83.19,9.53 80.33,6.67 RPI.3
  Bottom 0.254: v72.39,14.61 73.03,14.61 73.98,15.56 78.11,15.56 80.33,13.34 82.23,13.34 v83.19,14.29
TX
  Top 0.254: R6.1 66.99,16.93 T3.2 69.15,18.64 JTX.1
TX_IO14
  Top 0.254: RPI.8 76.52,3.49 76.52,6.67 78.74,8.89 78.74,13.02 72.87,18.89 JTX.2
VCC
  Top 0.254: JVCC.2 77.34,51.24 77.79,50.8 FTDI.3
VIN
  Top 0.61: C4.1 33.02,11.96 IN.1
  Bottom 0.61: PWR.3 13.97,11.43 15.88,13.34 25.72,13.34 | 25.72,13.34 33.02,13.34 | 33.02,13.34 49.85,13.34 54.61,8.57 ARD.VIN | 33.02,13.34 IN.1 | +.1 25.72,4.13 25.72,13.34

### Text on the board
Top: www.watterott.com | TOP | Rev 1.1
Bottom: BOT
tPlace: open | hardware | github.com/watterott/RPi-ShieldBridge | o | RPi ShieldBridge | Input: 3-11V | Pololu S7V7F5 | Step-Up/Down
bPlace: MISO | VCC | SCK | RST | MOSI | GND | Input: 3-11V
tNames: A5 | A4 | Tx | Rx
Reference: Silkscreen: 21 tPlace + 25 tNames + 22 bPlace